# EAGLE schematic Debug-unit (rev01) (EAGLE 6.6.0)

## Sheet 1 of 2
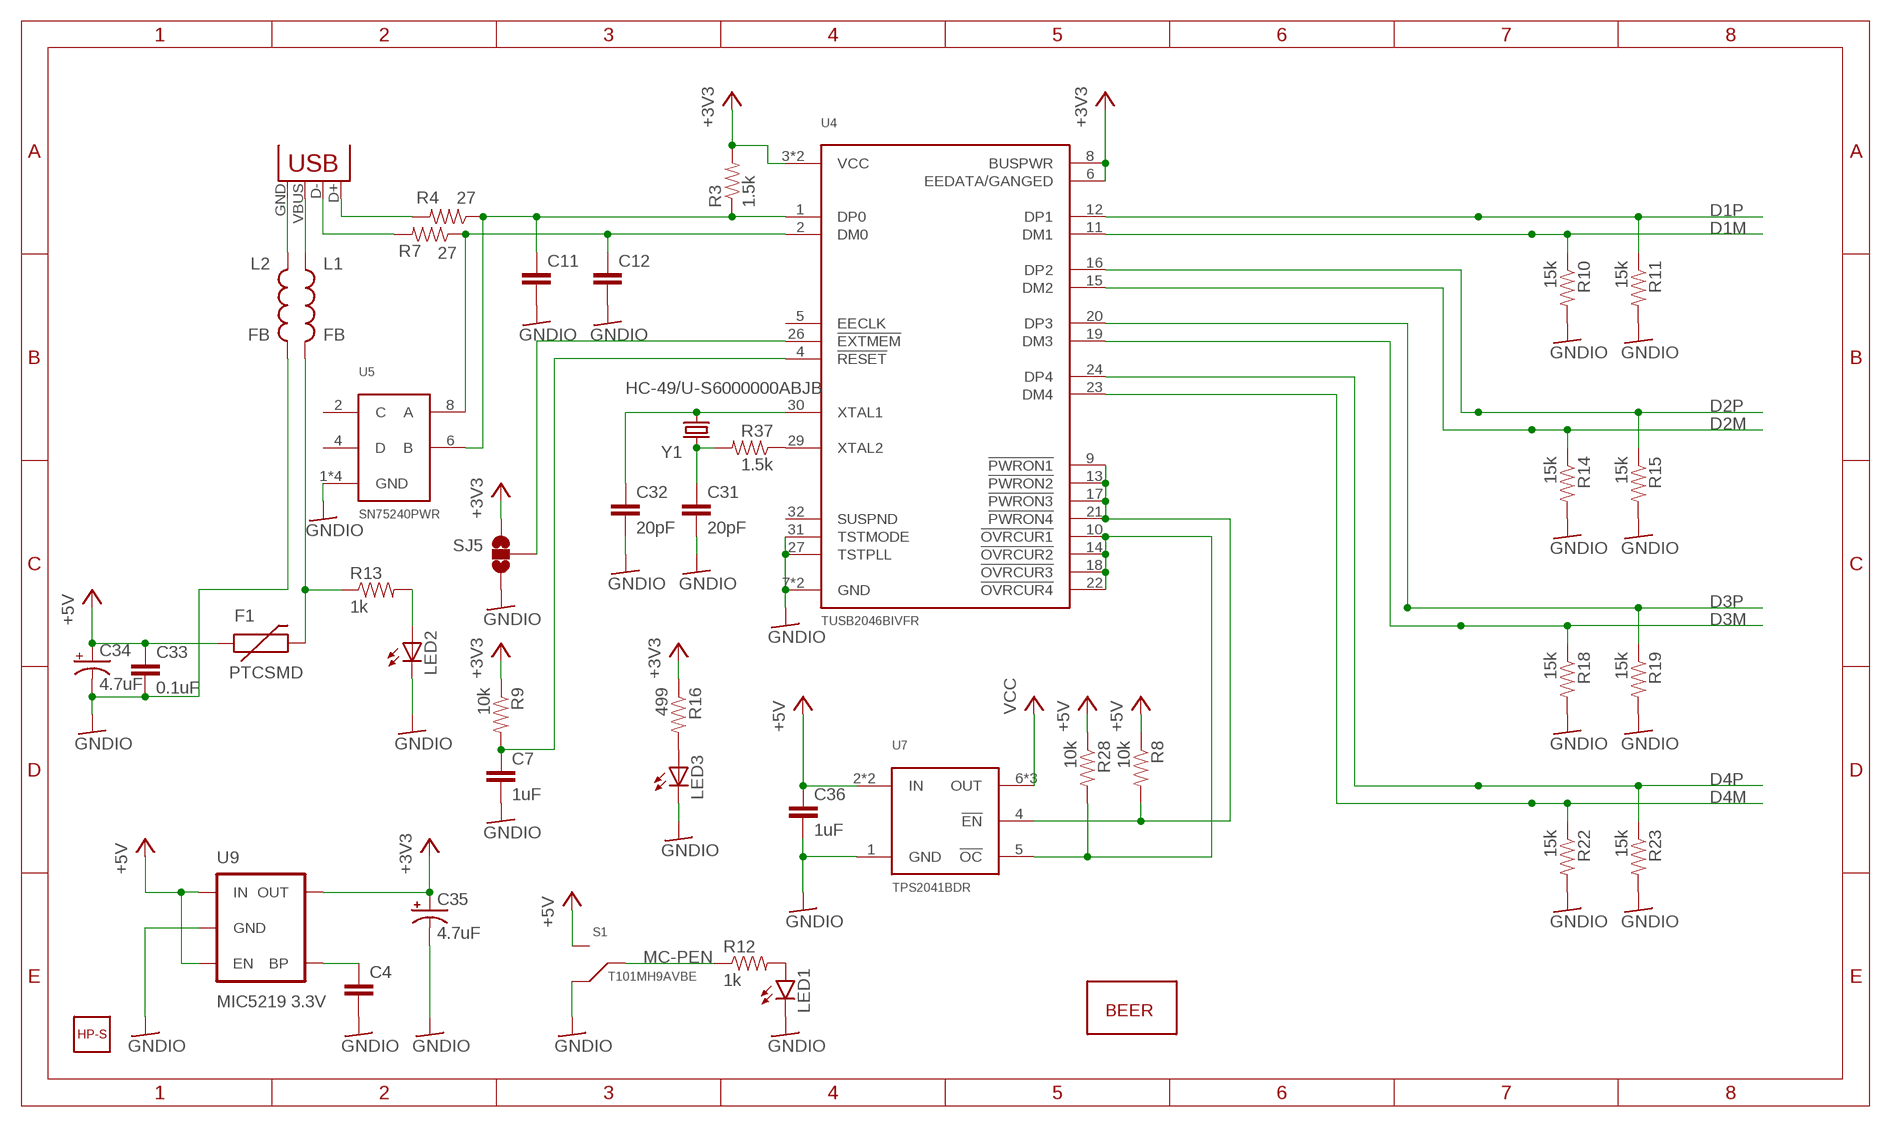
[diagram p0: schematic, sheet 1]

### Parts
C4  CAP0805  [0805]
C7  1uF  CAP0805  [0805]
C11  CAP0805  [0805]
C12  CAP0805  [0805]
C31  20pF  CAP0805  [0805]
C32  20pF  CAP0805  [0805]
C33  0.1uF  CAP0805  [0805]
C34  4.7uF  CAP_POL1206  [EIA3216]
C35  4.7uF  CAP_POL1206  [EIA3216]
C36  1uF  CAP0805  [0805]
F1  PTCSMD  [PTC-1206]
JP9  USB-B  USBPTH  [USB-B-PTH]
L1  FB  INDUCTOR0805  [0805]
L2  FB  INDUCTOR0805  [0805]
LED1  LED-3MM-NO_SILK  [LED3MM-NS]
LED2  LEDCHIP-LED0805  [CHIP-LED0805]
LED3  LEDCHIP-LED0805  [CHIP-LED0805]
R3  1.5k  RESISTOR0805-RES  [0805]
R4  27  RESISTOR0805-RES  [0805]
R7  27  RESISTOR0805-RES  [0805]
R8  10k  RESISTOR0805-RES  [0805]
R9  10k  RESISTOR0805-RES  [0805]
R10  15k  RESISTOR0805-RES  [0805]
R11  15k  RESISTOR0805-RES  [0805]
R12  1k  RESISTOR0805-RES  [0805]
R13  1k  RESISTOR0805-RES  [0805]
R14  15k  RESISTOR0805-RES  [0805]
R15  15k  RESISTOR0805-RES  [0805]
R16  499  RESISTOR0805-RES  [0805]
R18  15k  RESISTOR0805-RES  [0805]
R19  15k  RESISTOR0805-RES  [0805]
R22  15k  RESISTOR0805-RES  [0805]
R23  15k  RESISTOR0805-RES  [0805]
R28  10k  RESISTOR0805-RES  [0805]
R37  1.5k  RESISTOR0805-RES  [0805]
S1  T101MH9AVBE  [T101MH9AVBE]
SJ5  JUMPER-PAD-3-NOFULL_BOX_SILK  [PAD-JUMPER-3-NO_YES_SILK_FULL_BOX]
U4  TUSB2046BIVFR  [LQFP-32]
U5  SN75240PWR  [TSSOP-8]
U7  TPS2041BDR  [SO-8]
U9  MIC5219 3.3V  V_REG_MIC52193.3V  [SOT23-5]
U$1  HP-3651-B  [HP-3651-B]
U$3  BEERS  [B-S]
Y1  HC-49/U-S6000000ABJB  CRYSTALHC49US  [HC49US]

### Nets
+3V3: C35.A(+) R3.2 R9.1 R16.1 SJ5.1 U4.3(VCC) U4.6(EEDATA/GANGED) U4.8(BUSPWR) U4.25(VCC) U9.5(OUT)
+5V: C33.1 C34.A(+) C36.1 F1.1 R8.1 R28.1 S1.1(NO) U7.2(IN) U7.3(IN) U9.1(IN) U9.3(EN)
D1M: R10.1 U4.11(DM1) ; also sheet 2
D1P: R11.1 U4.12(DP1) ; also sheet 2
D2M: R14.1 U4.15(DM2) ; also sheet 2
D2P: R15.1 U4.16(DP2) ; also sheet 2
D3M: R18.1 U4.19(DM3) ; also sheet 2
D3P: R19.1 U4.20(DP3) ; also sheet 2
D4M: R22.1 U4.23(DM4) ; also sheet 2
D4P: R23.1 U4.24(DP4) ; also sheet 2
GNDIO: C4.2 C7.2 C11.2 C12.2 C31.2 C32.2 C33.2 C34.C(-) C35.C(-) C36.2 L2.2 LED1.K(C) LED2.C LED3.C R10.2 R11.2 R14.2 R15.2 R18.2 R19.2 R22.2 R23.2 S1.3(NC) SJ5.3 U4.7(GND) U4.27(TSTPLL) U4.28(GND) U4.31(TSTMODE) U5.1(GND) U5.3(GND) U5.5(GND) U5.7(GND) U7.1(GND) U9.2(GND) ; also sheet 2
MC-PEN: R12.1 S1.2(C) ; also sheet 2
N$7: C4.1 U9.4(BP)
N$11: R8.2 U4.9(!PWRON1) U4.13(!PWRON2) U4.17(!PWRON3) U4.21(!PWRON4) U7.4(!EN)
N$13: LED2.A R13.2
N$25: LED3.A R16.2
N$28: R28.2 U4.10(!OVRCUR1) U4.14(!OVRCUR2) U4.18(!OVRCUR3) U4.22(!OVRCUR4) U7.5(!OC)
N$38: R37.1 U4.29(XTAL2)
N$39: C31.1 R37.2 Y1.2
N$40: C32.1 U4.30(XTAL1) Y1.1
N$41: C11.1 R3.1 R4.1 U4.1(DP0) U5.6(B)
N$42: SJ5.2 U4.26(!EXTMEM)
N$43: C12.1 R7.1 U4.2(DM0) U5.8(A)
N$44: JP9.D+ R4.2
N$45: JP9.D- R7.2
N$46: C7.1 R9.2 U4.4(!RESET)
N$49: JP9.VBUS L1.1
N$50: JP9.GND L2.1
N$51: F1.2 L1.2 R13.1
N$52: LED1.A R12.2
VCC: U7.6(OUT) U7.7(OUT) U7.8(OUT) ; also sheet 2
Unconnected: U4.5(EECLK) U4.32(SUSPND) U5.2(C) U5.4(D)

## Sheet 2 of 2
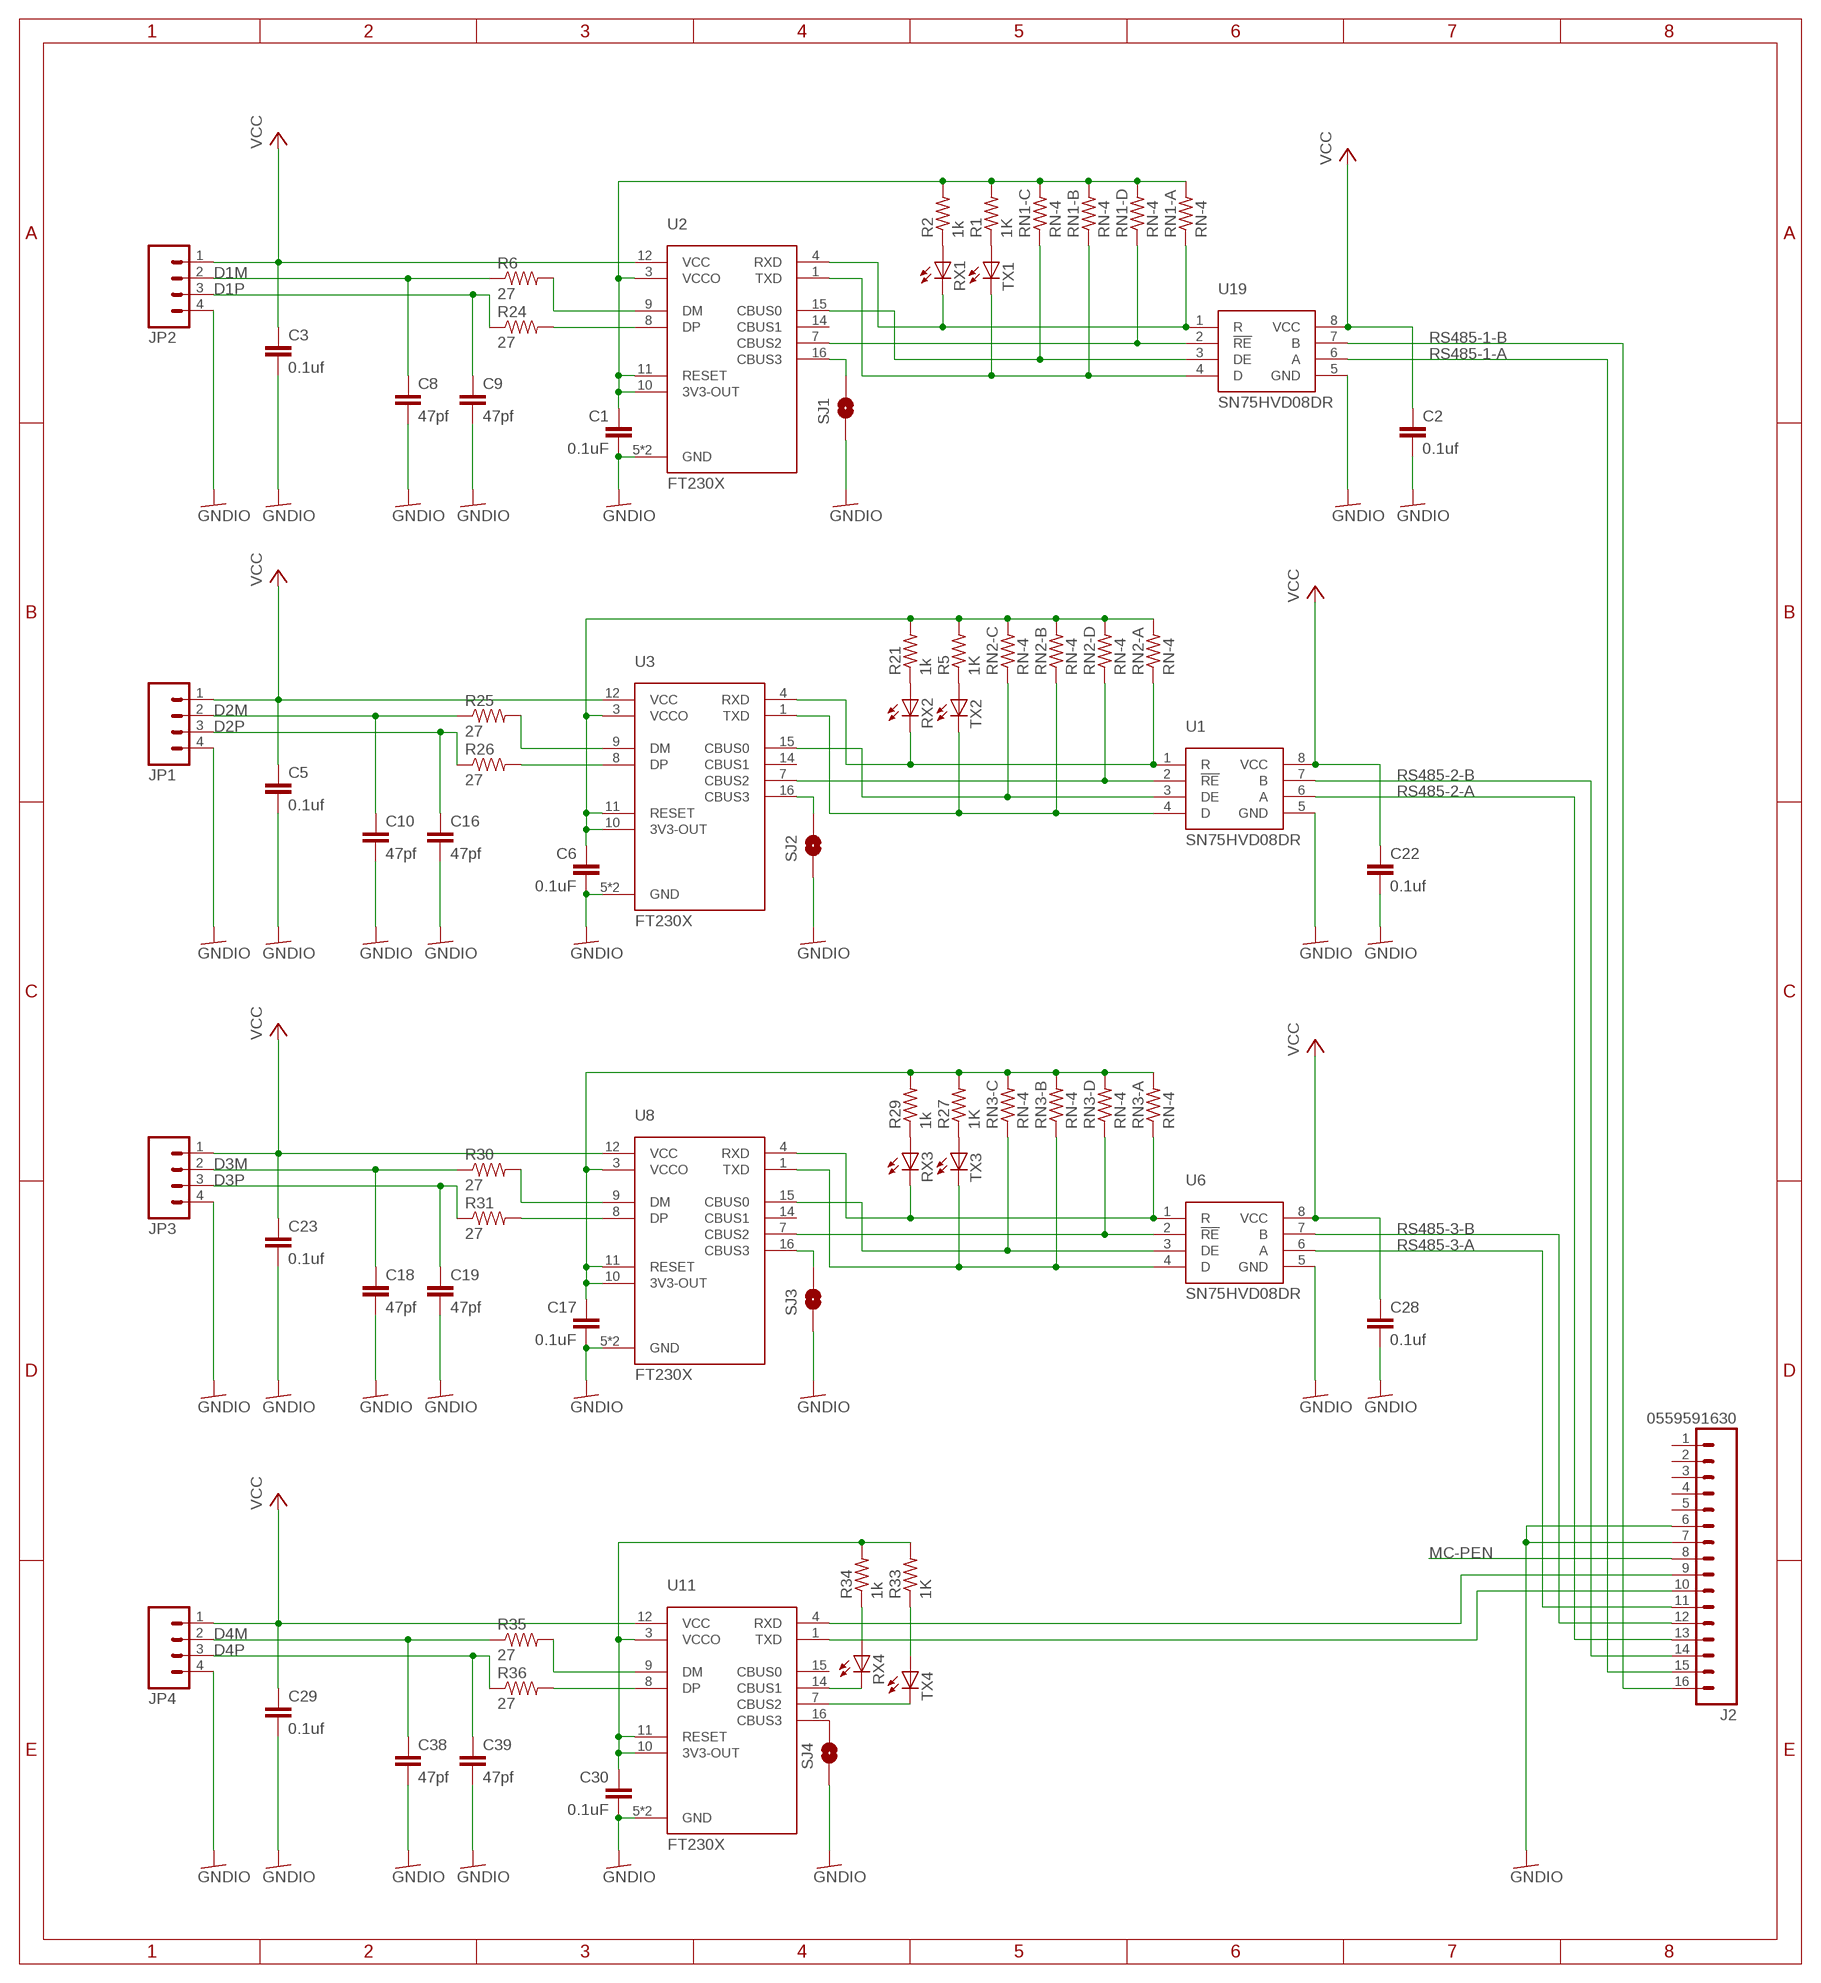
[diagram p1: schematic, sheet 2]

### Parts
C1  0.1uF  CAP0805  [0805]
C2  0.1uf  CAP0805  [0805]
C3  0.1uf  CAP0805  [0805]
C5  0.1uf  CAP0805  [0805]
C6  0.1uF  CAP0805  [0805]
C8  47pf  CAP0805  [0805]
C9  47pf  CAP0805  [0805]
C10  47pf  CAP0805  [0805]
C16  47pf  CAP0805  [0805]
C17  0.1uF  CAP0805  [0805]
C18  47pf  CAP0805  [0805]
C19  47pf  CAP0805  [0805]
C22  0.1uf  CAP0805  [0805]
C23  0.1uf  CAP0805  [0805]
C28  0.1uf  CAP0805  [0805]
C29  0.1uf  CAP0805  [0805]
C30  0.1uF  CAP0805  [0805]
C38  47pf  CAP0805  [0805]
C39  47pf  CAP0805  [0805]
J2  0559591630  [0559591630]
JP1  M04POLAR_LOCK  [MOLEX-1X4_LOCK]
JP2  M04POLAR_LOCK  [MOLEX-1X4_LOCK]
JP3  M04POLAR_LOCK  [MOLEX-1X4_LOCK]
JP4  M04POLAR_LOCK  [MOLEX-1X4_LOCK]
R1  1K  R-US_R0805  [R0805]
R2  1k  R-US_R0805  [R0805]
R5  1K  R-US_R0805  [R0805]
R6  27  RESISTOR0805-RES  [0805]
R21  1k  R-US_R0805  [R0805]
R24  27  RESISTOR0805-RES  [0805]
R25  27  RESISTOR0805-RES  [0805]
R26  27  RESISTOR0805-RES  [0805]
R27  1K  R-US_R0805  [R0805]
R29  1k  R-US_R0805  [R0805]
R30  27  RESISTOR0805-RES  [0805]
R31  27  RESISTOR0805-RES  [0805]
R33  1K  R-US_R0805  [R0805]
R34  1k  R-US_R0805  [R0805]
R35  27  RESISTOR0805-RES  [0805]
R36  27  RESISTOR0805-RES  [0805]
RN1  RN-4  [CRA06S]
RN2  RN-4  [CRA06S]
RN3  RN-4  [CRA06S]
RX1  LEDCHIPLED_0805  [CHIPLED_0805]
RX2  LEDCHIPLED_0805  [CHIPLED_0805]
RX3  LEDCHIPLED_0805  [CHIPLED_0805]
RX4  LEDCHIPLED_0805  [CHIPLED_0805]
SJ1  JUMPER-PAD-2-NOYES_SILK  [PAD-JUMPER-2-NO_YES_SILK]
SJ2  JUMPER-PAD-2-NOYES_SILK  [PAD-JUMPER-2-NO_YES_SILK]
SJ3  JUMPER-PAD-2-NOYES_SILK  [PAD-JUMPER-2-NO_YES_SILK]
SJ4  JUMPER-PAD-2-NOYES_SILK  [PAD-JUMPER-2-NO_YES_SILK]
TX1  LEDCHIPLED_0805  [CHIPLED_0805]
TX2  LEDCHIPLED_0805  [CHIPLED_0805]
TX3  LEDCHIPLED_0805  [CHIPLED_0805]
TX4  LEDCHIPLED_0805  [CHIPLED_0805]
U1  SN75HVD08DR  [SO-8]
U2  FT230X  [SSOP-16]
U3  FT230X  [SSOP-16]
U6  SN75HVD08DR  [SO-8]
U8  FT230X  [SSOP-16]
U11  FT230X  [SSOP-16]
U19  SN75HVD08DR  [SO-8]

### Nets
3V: C1.1 R1.2 R2.2 RN1.5 RN1.6 RN1.7 RN1.8 U2.3(VCCO) U2.10(3V3-OUT) U2.11(RESET)
3V1: C6.1 R5.2 R21.2 RN2.5 RN2.6 RN2.7 RN2.8 U3.3(VCCO) U3.10(3V3-OUT) U3.11(RESET)
3V2: C17.1 R27.2 R29.2 RN3.5 RN3.6 RN3.7 RN3.8 U8.3(VCCO) U8.10(3V3-OUT) U8.11(RESET)
3V3: C30.1 R33.2 R34.2 U11.3(VCCO) U11.10(3V3-OUT) U11.11(RESET)
D1M: C8.1 JP2.2 R6.1 ; also sheet 1
D1P: C9.1 JP2.3 R24.1 ; also sheet 1
D2M: C10.1 JP1.2 R25.1 ; also sheet 1
D2P: C16.1 JP1.3 R26.1 ; also sheet 1
D3M: C18.1 JP3.2 R30.1 ; also sheet 1
D3P: C19.1 JP3.3 R31.1 ; also sheet 1
D4M: C38.1 JP4.2 R35.1 ; also sheet 1
D4P: C39.1 JP4.3 R36.1 ; also sheet 1
GNDIO: C1.2 C2.2 C3.2 C5.2 C6.2 C8.2 C9.2 C10.2 C16.2 C17.2 C18.2 C19.2 C22.2 C23.2 C28.2 C29.2 C30.2 C38.2 C39.2 J2.6 J2.7 JP1.4 JP2.4 JP3.4 JP4.4 SJ1.1 SJ2.1 SJ3.1 SJ4.1 U1.5(GND) U2.5(GND) U2.13(GND) U3.5(GND) U3.13(GND) U6.5(GND) U8.5(GND) U8.13(GND) U11.5(GND) U11.13(GND) U19.5(GND) ; also sheet 1
MC-PEN: J2.8 ; also sheet 1
N$1: R1.1 TX1.A
N$2: R2.1 RX1.A
N$3: SJ1.2 U2.16(CBUS3)
N$4: R5.1 TX2.A
N$5: RN1.4 U2.7(CBUS2) U19.2(!RE)
N$6: RN1.3 U2.15(CBUS0) U19.3(DE)
N$8: R6.2 U2.9(DM)
N$9: R24.2 U2.8(DP)
N$10: R21.1 RX2.A
N$12: R25.2 U3.9(DM)
N$14: R26.2 U3.8(DP)
N$15: RN2.4 U1.2(!RE) U3.7(CBUS2)
N$16: RN2.3 U1.3(DE) U3.15(CBUS0)
N$17: SJ2.2 U3.16(CBUS3)
N$18: R27.1 TX3.A
N$19: R29.1 RX3.A
N$20: R30.2 U8.9(DM)
N$21: R31.2 U8.8(DP)
N$22: RN3.4 U6.2(!RE) U8.7(CBUS2)
N$23: RN3.3 U6.3(DE) U8.15(CBUS0)
N$24: SJ3.2 U8.16(CBUS3)
N$31: R33.1 TX4.A
N$32: R34.1 RX4.A
N$33: TX4.C U11.7(CBUS2)
N$34: RX4.C U11.14(CBUS1)
N$35: R35.2 U11.9(DM)
N$36: R36.2 U11.8(DP)
N$37: SJ4.2 U11.16(CBUS3)
N$47: J2.10 U11.1(TXD)
N$48: J2.9 U11.4(RXD)
RS485-1-A: J2.15 U19.6(A)
RS485-1-B: J2.16 U19.7(B)
RS485-2-A: J2.13 U1.6(A)
RS485-2-B: J2.14 U1.7(B)
RS485-3-A: J2.11 U6.6(A)
RS485-3-B: J2.12 U6.7(B)
RXD0: RN1.1 RX1.C U2.4(RXD) U19.1(R)
RXD1: RN2.1 RX2.C U1.1(R) U3.4(RXD)
RXD2: RN3.1 RX3.C U6.1(R) U8.4(RXD)
TXD0: RN1.2 TX1.C U2.1(TXD) U19.4(D)
TXD1: RN2.2 TX2.C U1.4(D) U3.1(TXD)
TXD2: RN3.2 TX3.C U6.4(D) U8.1(TXD)
VCC: C2.1 C3.1 C5.1 C22.1 C23.1 C28.1 C29.1 JP1.1 JP2.1 JP3.1 JP4.1 U1.8(VCC) U2.12(VCC) U3.12(VCC) U6.8(VCC) U8.12(VCC) U11.12(VCC) U19.8(VCC) ; also sheet 1
Unconnected: J2.1 J2.2 J2.3 J2.4 J2.5 U2.14(CBUS1) U3.14(CBUS1) U8.14(CBUS1) U11.15(CBUS0)

## Library data of the parts
C1-C3 C5 C6 C8-C10 C16-C19 C22 C23 C28-C30 C38 C39 = SparkFun:CAP: Capacitor Standard 0603 ceramic capacitor, and 0.1" leaded capacitor.
C4 C7 C11 C12 C31-C33 C36 = SparkFun-Passives:CAP: Capacitor Standard 0603 ceramic capacitor, and 0.1" leaded capacitor.
C34 C35 = SparkFun-Capacitors:CAP_POL: Capacitor Polarized These are standard SMD and PTH capacitors. Normally 10uF, 47uF, and 100uF in electrolytic and tantalum varieties. Always verify the external diameter of the through hole cap, it varies with capacity, voltage, and manufacturer. The EIA devices should be standard.
F1 = SparkFun-PowerIC:PTC: Resettable Fuse PTC Resettable Fuse. Spark Fun Electronics SKU : COM-08357; PROD_ID: RES-11150
J2 = NASA_LIB:0559591630
JP1-JP4 = SparkFun-Connectors:M04: Header 4 Standard 4-pin 0.1" header. Use with straight break away headers (SKU : PRT-00116), right angle break away headers (PRT-00553), swiss pins (PRT-00743), machine pins (PRT-00117), and female headers (PRT-00115). Molex polarized connector foot print use with SKU : PRT-08231 with associated crimp pins and housings. 1MM SMD Version SKU: PRT-10208
JP9 = SparkFun-Connectors:USB: USB Connectors USB-B-PTH is fully proven SKU : PRT-00139/CONN-08278 USB-miniB is fully proven SKU : PRT-00587 USB-A-PCB is untested. USB-A-H is throughly reviewed, but untested. Spark Fun Electronics SKU : PRT-00437 USB-B-SMT is throughly reviewed, but untested. Needs silkscreen touching up. USB-A-S has not been used/tested USB-MB-H has not been used/tested USB-MICROB has been used. CONN-09505; PROD_ID: CONN-08278
L1 L2 = SparkFun-Passives:INDUCTOR: Inductors Basic Inductor/Choke - 0603 and 1206. Footprints are not proven and vary greatly between part numbers. SRN6045- 33uH, 20% 1.4A SDR0403-560KL - 56uH, 10%, 500mA RMS/740mA peak
LED1 = SparkFun-LED:LED: LEDs Standard schematic elements and footprints for 5mm, 3mm, 1206, and 0603 sized LEDs. 5mm - Spark Fun Electronics SKU : COM-00529 (and others)
LED2 LED3 RX1-RX4 TX1-TX4 = adafruit:LED: LED OSRAM: - CHIPLED LG R971, LG N971, LY N971, LG Q971, LY Q971, LO R971, LY R971 LH N974, LH R974 LS Q976, LO Q976, LY Q976 LO Q996 - Hyper CHIPLED LW Q18S LB Q993, LB Q99A, LB R99A - SideLED LS A670, LO A670, LY A670, LG A670, LP A670 LB A673, LV A673, LT A673, LW A673 LH A674 LY A675 LS A676, LA A676, LO A676, LY A676, LW A676 LS A679, LY A679, LG A679 - Hyper Micro SIDELED® LS Y876, LA Y876, LO Y876, LY Y876 LT Y87S - SmartLED LW L88C, LW L88S LB L89C, LB L89S, LG L890 LS L89K, LO L89K, LY L89K LS L896, LA L896, LO L896, LY L896 - TOPLED LS T670, LO T670, LY T670, LG T670, LP T670 LSG T670, LSP T670, LSY T670, LOP T670, LYG T670 LG T671, LOG T671, LSG T671 LB T673, LV T673, LT T673, LW T673 LH T674 LS T676, LA T676, LO T676, LY T676, LB T676, LH T676, LSB T676, LW T676 LB T67C, LV T67C, LT T67C, LS T67K, LO T67K, LY T67K, LW E67C LS E67B, LA E67B, LO E67B, LY E67B, LB E67C, LV E67C, LT E67C LW T67C LS T679, LY T679, LG T679 LS T770, LO T770, LY T770, LG T770, LP T770 LB T773, LV T773, LT T773, LW T773 LH T774 LS E675, LA E675, LY E675, LS T675 LS T776, LA T776, LO T776, LY T776, LB T776 LHGB T686 LT T68C, LB T68C - Hyper Mini TOPLED® LB M676 - Mini TOPLED Santana® LG M470 LS M47K, LO M47K, LY M47K Source: http://www.osram.convergy.de/
R1 R2 R5 R21 R27 R29 R33 R34 = adafruit:R-US_: RESISTOR, American symbol
R3 R4 R6-R16 R18 R19 R22-R26 R28 R30 R31 R35-R37 = SparkFun-Passives:RESISTOR: Resistor Basic schematic elements and footprints for 0603, 1206, and PTH resistors.
RN1-RN3 = DFT2:RN-4
S1 = FSAE Eletric:T101MH9AVBE
SJ1-SJ4 = SparkFun-Passives:JUMPER-PAD-2-NO
SJ5 = SparkFun-Passives:JUMPER-PAD-3-NO
U1 U6 U19 = FSAE Eletric:SN75HVD08DR
U2 U3 U8 U11 = FSAE Eletric:FT230X
U4 = FSAE Eletric:TUSB2046BIVFR
U5 = FSAE Eletric:SN75240PWR
U7 = FSAE Eletric:TPS2041BDR
U9 = SparkFun-PowerIC:V_REG_MIC5219: V_REG MIC5219 Standard 500mA LDO voltage regulator in SOT-23 layout. Micrel part MIC5219. BP (by-pass) pin is used to lower output noise with 470pF cap, may be left open.; PROD_ID: VREG-09872
U$1 = FSAE Eletric:HP-3651-B
U$3 = Pic:BEER
Y1 = SparkFun-FreqCtrl:CRYSTAL: Various standard crystals. Proven footprints. Spark Fun Electronics SKU : COM-00534